# Altium schematic sheet TAJ1051T.SchDoc
size A4
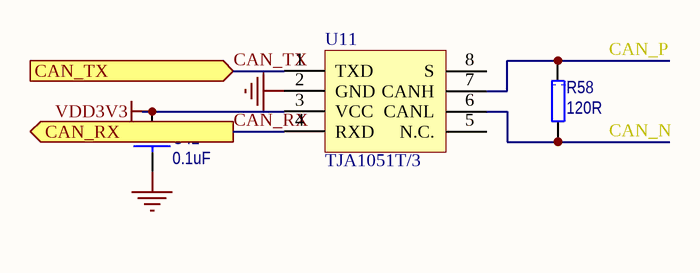
[diagram p0: TAJ1051T.SchDoc]

## Parts
C42  0.1uF  [1608[0603]]
R58  120R  [1608[0603]R]
U11  TJA1051T/3  [SOIC-SN8_N]

## Ports
CAN_RX (out), CAN_TX (in)

## Nets
GND: C42.2 U11.2(GND)
VDD3V3: C42.1 U11.3(VCC)
CAN_N: R58.2 U11.6(CANL)
CAN_P: R58.1 U11.7(CANH)
CAN_RX: U11.4(RXD) ; port CAN_RX
CAN_TX: U11.1(TXD) ; port CAN_TX

Not connected (* = marked no-connect by the designer): U11 5(N.C.) 8(S)

## Library data of the parts
C42 = CAP: Capacitor; Manufacturer: TDK; Type: 无铅电容; Model: C0603X7R1H104K; Value: 0.1uF
R58 = RES: Manufacturer: vishay; Model: RT0603DRD7D120RL; Value: 120R; Type: 无铅电阻
U11 = TJA1051T/3: IC; 公司: NXP